# EasyEDA Pro project ESIOT.eprj

# Schematic Schematic1

## Sheets
1 P1: Board Name: Board1; Create Date: 2026-05-07; Page Name: P1; Project Name: ESIOT; Schematic Name: Schematic1; Update Date: 2026-05-07; Company: EasyEDA.com; Page Size: A4; Version: V1.0
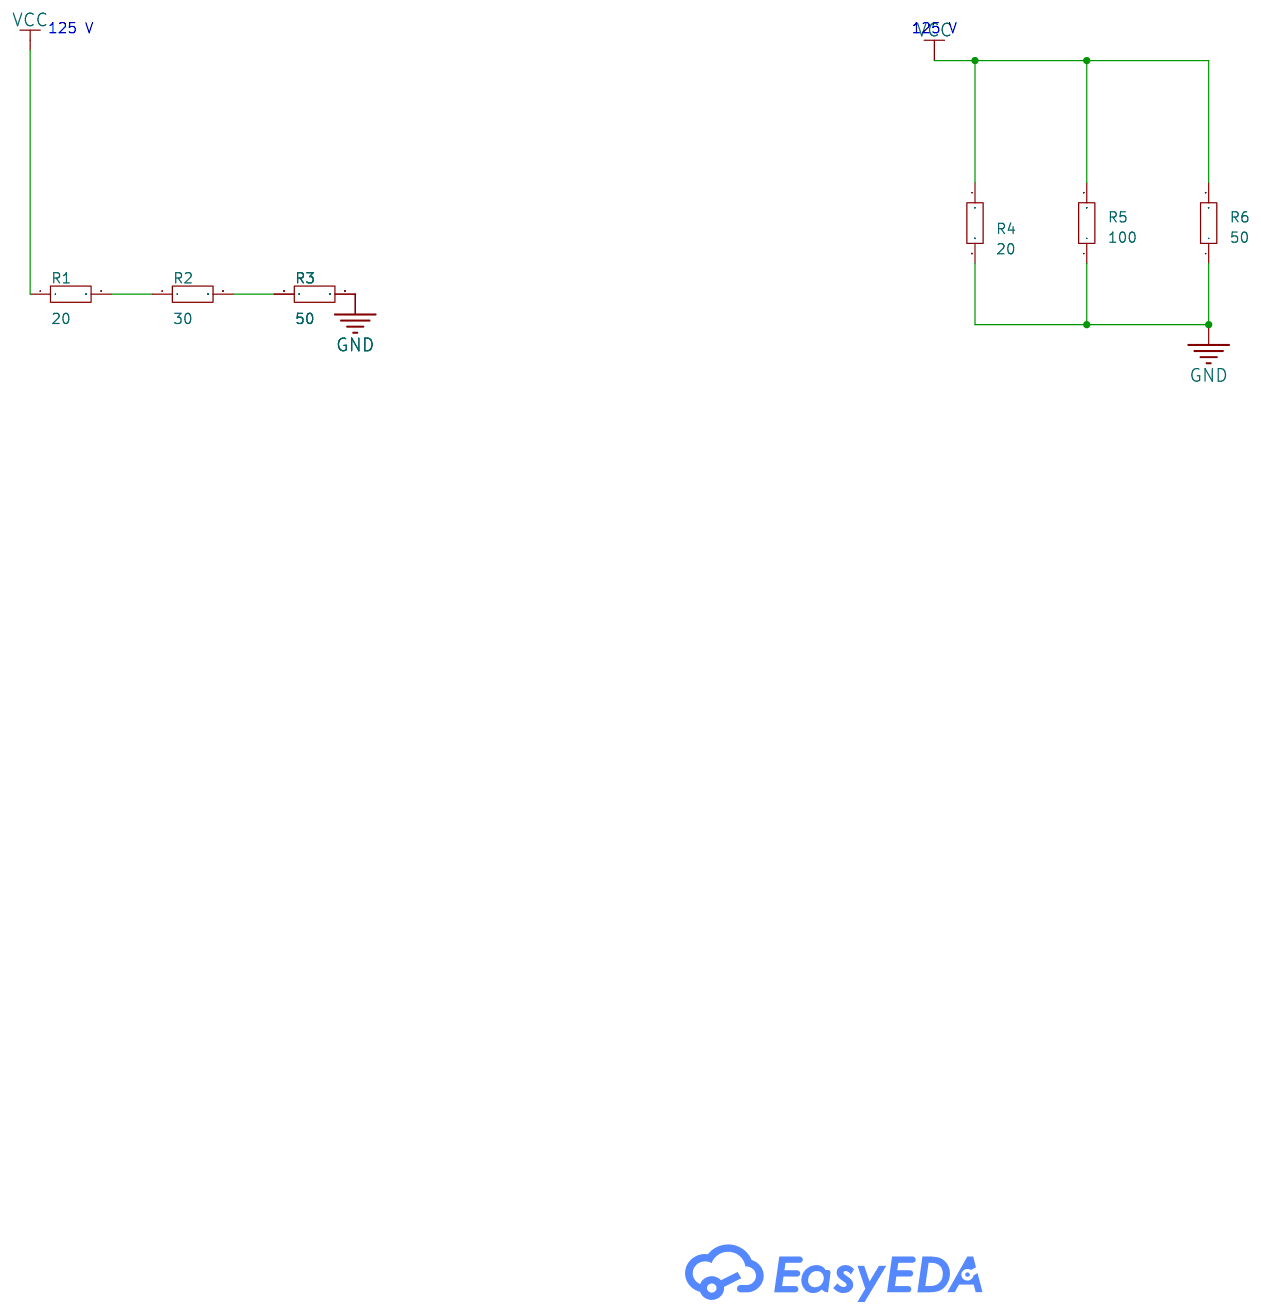
[diagram p0: P1]
2 P2: Page Name: P2
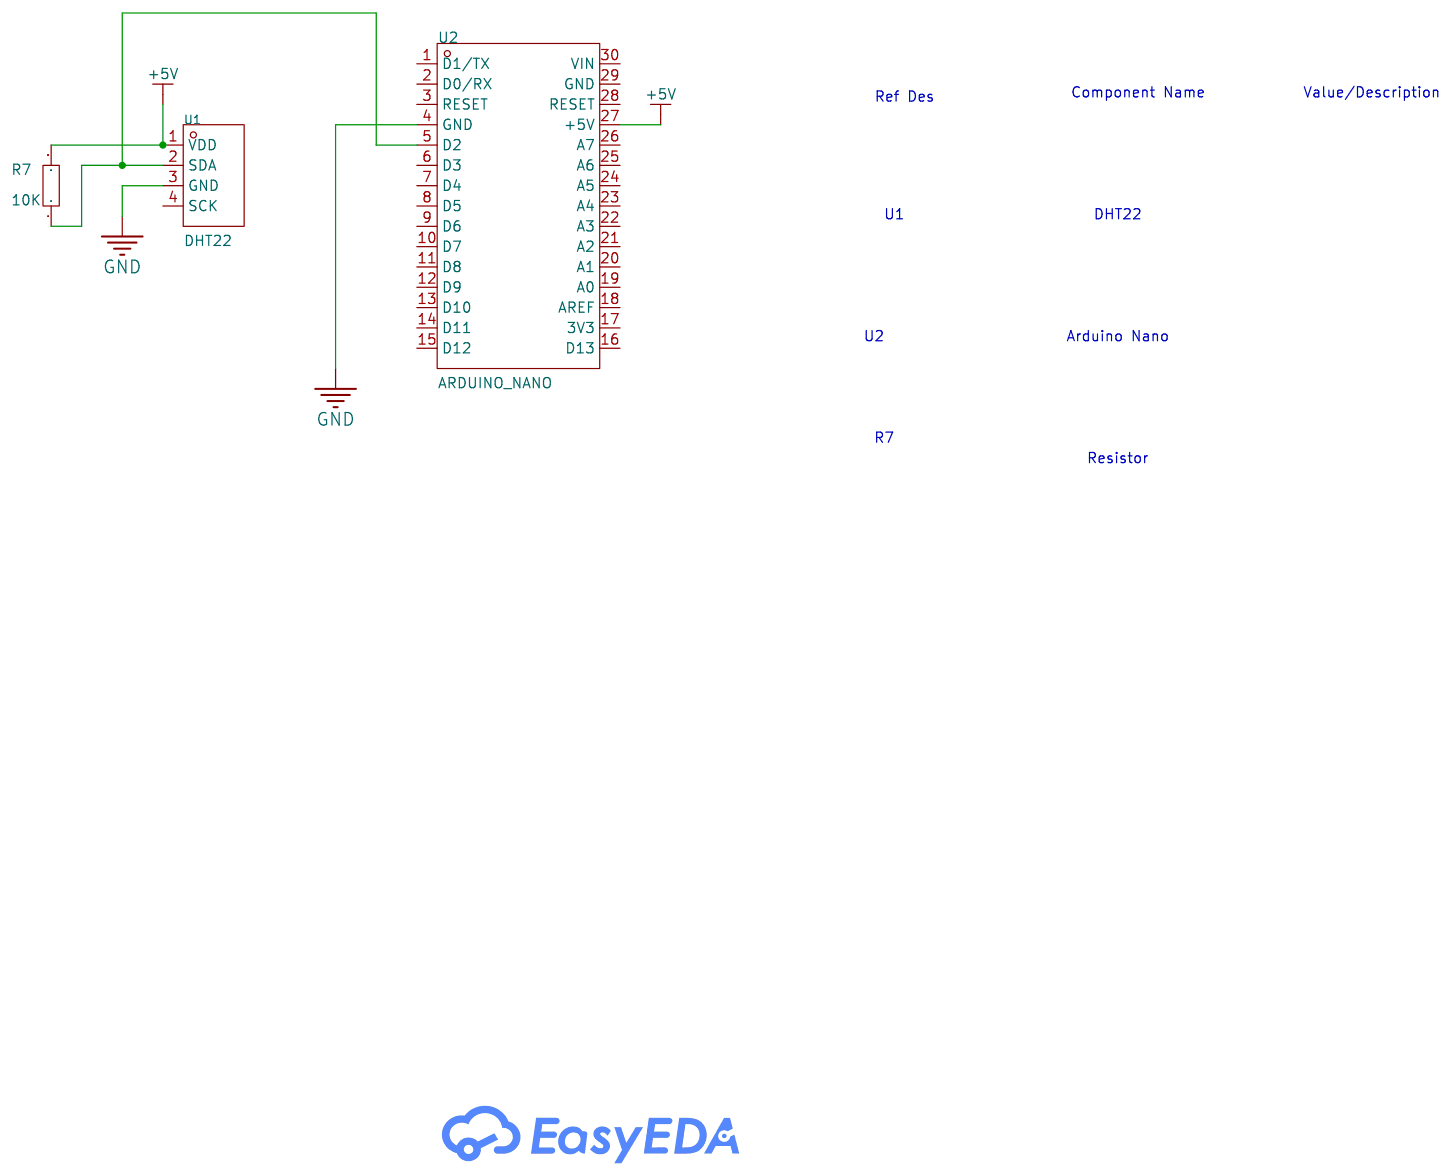
[diagram p1: P2]

## Parts
sheet P1
R1  20  [R0603]
R2  30  [R0603]
R3  50  [R0603]
R4  20  [R0603]
R5  100  [R0603]
R6  50  [R0603]
sheet P2
R7  10K  [R0603]
U1  DHT22  [SENSOR-TH_HAIGU_DHT22]
U2  ARDUINO_NANO  [COMM-TH_ARDUINO_NANO]

## Library data of the parts
R1-R7 = Res_0603: Supplier Footprint: 0603
U1 = DHT22: Temperature:-40℃~+80℃ Temperature:-40℃~+80℃ Humidity:5%RH~99%RH Humidity:5%RH~99%RH Supply Voltage:3.3V Supply Voltage:3.3V Supply Current:500uA Resolution:±3%RH Resolution:±3%RH; LCSC Part Name: 数字温湿度模块12mm*15.5mm*5.9mm; Supplier Part: C2880291; Manufacturer: HAIGU(广州海谷); Supplier Footprint: 插件; JLCPCB Part Class: Extended Part; Datasheet: https://atta.szlcsc.com/upload/public/pdf/source/20230523/7507864DBB8AF99FF82B5DD1568971DB.pdf; Supplier: LCSC; Temperature: -40℃~+80℃; Humidity: 5%RH~99%RH; Supply Voltage: 3.3V; Supply Current: 500uA; Resolution: ±3%RH
U2 = ARDUINO_NANO: Supplier Part: C9900017879; Supplier Footprint: 插件; JLCPCB Part Class: Extended Part; Supplier: LCSC

## Nets
+5V: R7.2 U1.1(VDD) U2.27(+5V)
GND: R3.2 R4.2 R5.1 R6.1 U1.3(GND) U2.4(GND)
VCC: R1.1 R4.1 R5.2 R6.2
Net-(R1-2): R1.2 R2.1
Net-(R2-2): R2.2 R3.1
Net-(R7-1): R7.1 U1.2(SDA) U2.5(D2)

Not connected (* = marked no-connect by the designer): U1 4(SCK); U2 1(D1/TX) 2(D0/RX) 3(RESET) 6(D3) 7(D4) 8(D5) 9(D6) 10(D7) 11(D8) 12(D9) 13(D10) 14(D11) 15(D12) 16(D13) 17(3V3) 18(AREF) 19(A0) 20(A1) 21(A2) 22(A3) 23(A4) 24(A5) 25(A6) 26(A7) 28(RESET) 29(GND) 30(VIN)

## Notes on the sheets
sheet 1
- 125 V
- 125 V
sheet 2
- Component Name
- Value/Description
- Ref Des
- U1
- DHT22
- U2
- Arduino Nano
- R7
- Resistor
